# Altium schematic sheet LED-Holder_5mm.SchDoc
size A3
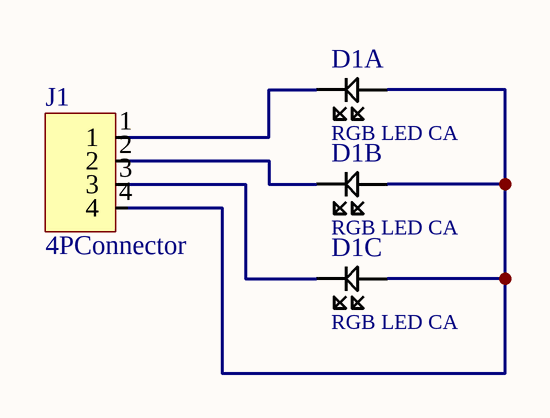
[diagram p0: LED-Holder_5mm.SchDoc]

## Parts
D1  RGB LED CA  [RGB-LED_Through Hole]  (parts A,B,C of 3)
J1  4PConnector  [JST_B4B-PH-K-S]

## Nets
NetD1_1: D1.1 J1.1
NetD1_2: D1.2 J1.4
NetD1_3: D1.3 J1.2
NetD1_4: D1.4 J1.3

## Library data of the parts
D1 = 3000: 5mm; id: 3000; pakke_opprettet_av: 815; pris: 1; nokkelord: 5mm RGB through-hole LED; pakketype: 92; pakke_opprettet: 19.02.2015 19:12:02; symbol_opprettet_av: 815; symbol_opprettet: 19.02.2015 19:50:16; navn: RGB LED CA
J1 = 3001: JST PH-Series 2mm Pitch; id: 3001; pakke_opprettet_av: 815; pris: 4; nokkelord: Connector, Kontakt; pakketype: 92; pakke_opprettet: 19.02.2015 20:53:06; symbol_opprettet_av: 815; symbol_opprettet: 28.06.2014 15:33:28; navn: JST_B4B-PH-K-S